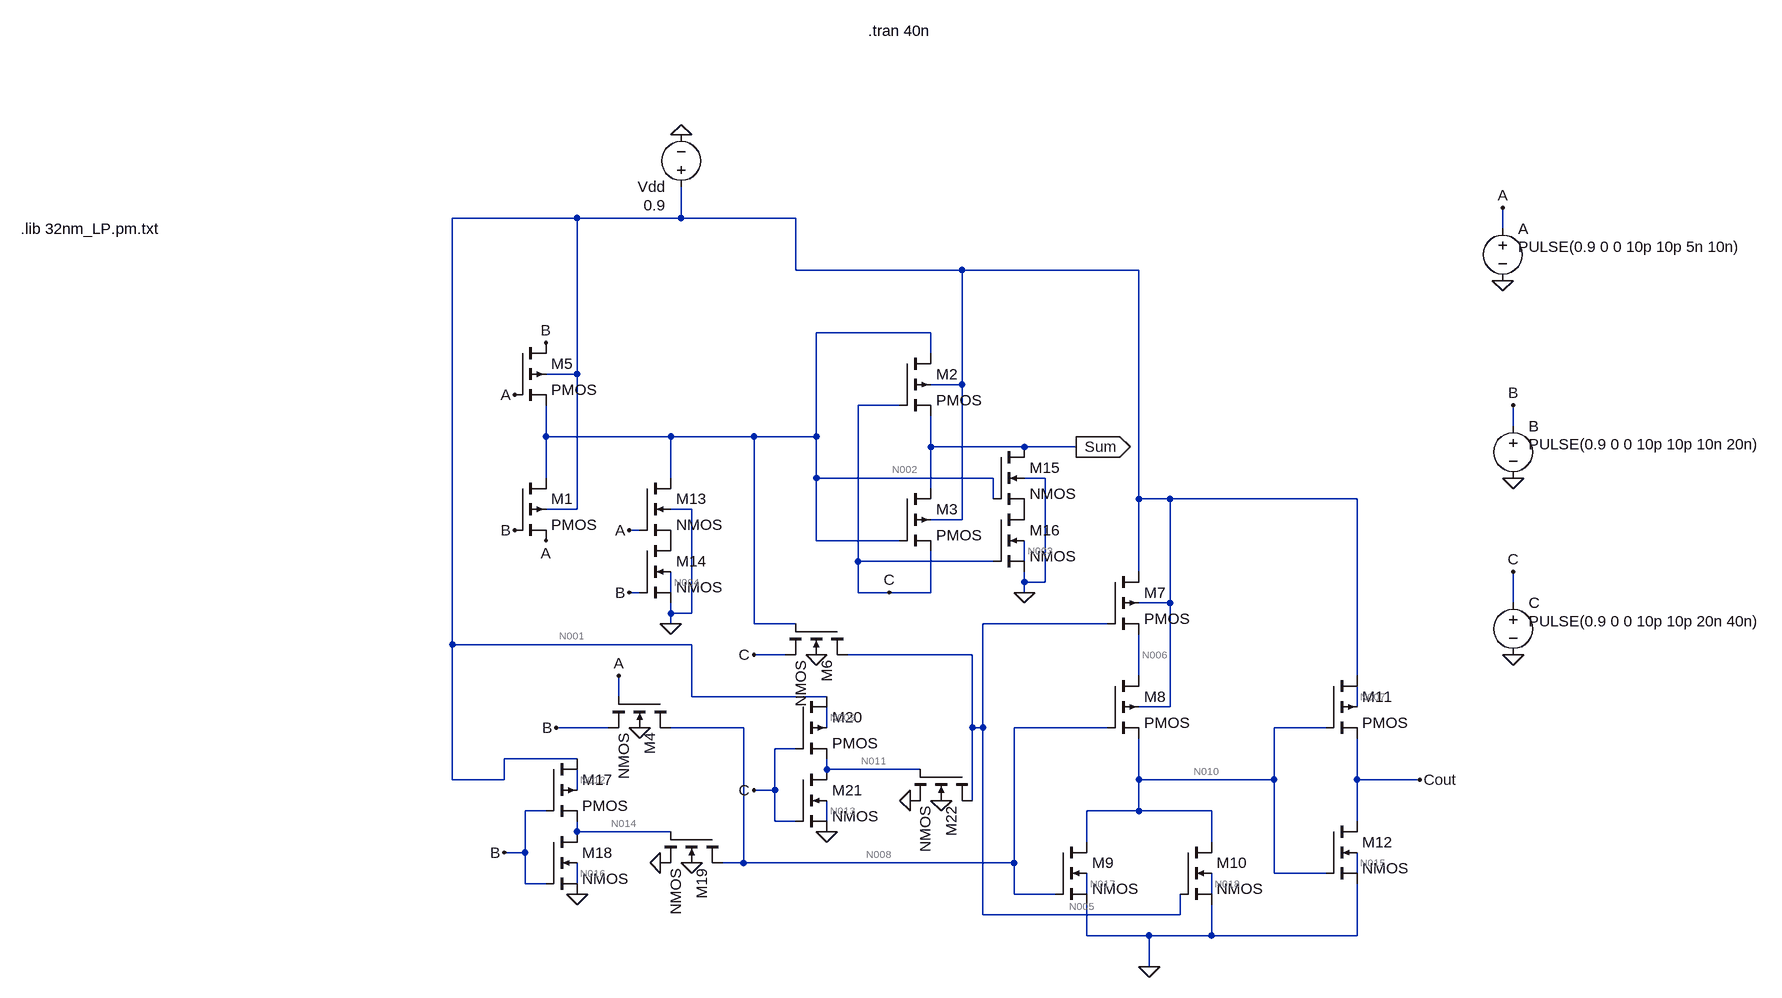
[diagram p0: schematic XA12T_45nm.asc]
XA12T_45nm.asc, the LTspice schematic file:
Version 4
SHEET 1 1060 3520
WIRE -800 -240 -992 -240
WIRE -640 -240 -640 -288
WIRE -640 -240 -800 -240
WIRE -464 -240 -640 -240
WIRE 624 -224 624 -256
WIRE -464 -160 -464 -240
WIRE -208 -160 -464 -160
WIRE 64 -160 -208 -160
WIRE -256 -64 -432 -64
WIRE -256 -32 -256 -64
WIRE -800 0 -800 -240
WIRE -800 0 -848 0
WIRE -208 16 -208 -160
WIRE -208 16 -256 16
WIRE -304 48 -368 48
WIRE 640 80 640 48
WIRE -848 96 -848 48
WIRE -656 96 -848 96
WIRE -528 96 -656 96
WIRE -432 96 -432 -64
WIRE -432 96 -528 96
WIRE -256 112 -256 64
WIRE -112 112 -256 112
WIRE -32 112 -112 112
WIRE -848 160 -848 96
WIRE -656 160 -656 96
WIRE -432 160 -432 96
WIRE -160 160 -432 160
WIRE -80 160 -112 160
WIRE -256 176 -256 112
WIRE -160 192 -160 160
WIRE 64 192 64 -160
WIRE 112 192 64 192
WIRE 400 192 112 192
WIRE -800 208 -800 0
WIRE -800 208 -848 208
WIRE -624 208 -656 208
WIRE -208 224 -208 16
WIRE -208 224 -256 224
WIRE -704 240 -720 240
WIRE -432 256 -432 160
WIRE -304 256 -432 256
WIRE -368 288 -368 48
WIRE -160 288 -368 288
WIRE -112 288 -112 256
WIRE 64 304 64 192
WIRE -112 320 -112 304
WIRE -80 320 -80 160
WIRE -80 320 -112 320
WIRE -704 336 -720 336
WIRE -656 336 -656 304
WIRE -368 336 -368 288
WIRE -320 336 -368 336
WIRE -256 336 -256 272
WIRE -256 336 -320 336
WIRE -112 336 -112 320
WIRE 112 352 112 192
WIRE 112 352 64 352
WIRE 640 352 640 304
WIRE -656 368 -656 352
WIRE -624 368 -624 208
WIRE -624 368 -656 368
WIRE -656 384 -656 368
WIRE -528 384 -528 96
WIRE -464 384 -528 384
WIRE 16 384 -176 384
WIRE -992 416 -992 -240
WIRE -624 416 -992 416
WIRE -480 432 -528 432
WIRE -192 432 -384 432
WIRE 64 464 64 400
WIRE 400 464 400 192
WIRE -736 496 -736 464
WIRE -624 496 -624 416
WIRE -416 496 -624 496
WIRE 112 512 112 352
WIRE 112 512 64 512
WIRE 400 512 400 480
WIRE -752 544 -832 544
WIRE -544 544 -656 544
WIRE -416 544 -416 512
WIRE -192 544 -192 432
WIRE -176 544 -176 384
WIRE -176 544 -192 544
WIRE 16 544 -128 544
WIRE 352 544 272 544
WIRE -464 576 -496 576
WIRE -800 592 -912 592
WIRE -416 608 -416 592
WIRE -272 608 -416 608
WIRE -992 624 -992 416
WIRE -912 624 -912 592
WIRE -912 624 -992 624
WIRE 64 624 64 560
WIRE 272 624 272 544
WIRE 272 624 64 624
WIRE 400 624 400 560
WIRE 496 624 400 624
WIRE -800 640 -800 608
WIRE -496 640 -496 576
WIRE -496 640 -528 640
WIRE -192 656 -192 544
WIRE -848 672 -880 672
WIRE 64 672 64 624
WIRE 64 672 -16 672
WIRE 176 672 64 672
WIRE -496 688 -496 640
WIRE -464 688 -496 688
WIRE -416 688 -416 656
WIRE 400 688 400 624
WIRE -800 704 -800 688
WIRE -656 704 -800 704
WIRE -16 720 -16 672
WIRE 176 720 176 672
WIRE -880 736 -880 672
WIRE -880 736 -912 736
WIRE -544 752 -544 544
WIRE -544 752 -576 752
WIRE -128 752 -128 544
WIRE -128 752 -544 752
WIRE 272 768 272 624
WIRE 352 768 272 768
WIRE 400 768 400 736
WIRE -880 784 -880 736
WIRE -848 784 -880 784
WIRE -800 784 -800 752
WIRE -128 800 -128 752
WIRE -64 800 -128 800
WIRE -16 800 -16 768
WIRE 176 800 176 768
WIRE -176 832 -176 544
WIRE 128 832 128 800
WIRE 128 832 -176 832
WIRE -16 864 -16 816
WIRE 80 864 -16 864
WIRE 176 864 176 816
WIRE 176 864 80 864
WIRE 400 864 400 784
WIRE 400 864 176 864
WIRE 80 912 80 864
FLAG 624 -144 0
FLAG 640 160 0
FLAG 640 432 0
FLAG 624 -256 A
FLAG 640 48 B
FLAG 640 304 C
FLAG -640 -368 0
FLAG -896 32 A
FLAG -848 256 A
FLAG -896 240 B
FLAG -848 -48 B
FLAG -704 544 0
FLAG -432 432 0
FLAG -832 544 B
FLAG -736 464 A
FLAG -528 432 C
FLAG 80 912 0
FLAG 496 624 Cout
FLAG -656 384 0
FLAG -720 240 A
FLAG -720 336 B
FLAG -112 336 0
FLAG -320 336 C
FLAG -32 112 Sum
IOPIN -32 112 Out
FLAG -800 800 0
FLAG -672 752 0
FLAG -624 752 0
FLAG -912 736 B
FLAG -416 704 0
FLAG -288 656 0
FLAG -240 656 0
FLAG -528 640 C
SYMBOL voltage 624 -240 R0
WINDOW 3 24 44 Left 2
WINDOW 123 0 0 Left 0
WINDOW 39 0 0 Left 0
SYMATTR Value PULSE(0.9 0 0 10p 10p 5n 10n)
SYMATTR InstName A
SYMBOL voltage 640 64 R0
WINDOW 3 24 44 Left 2
WINDOW 123 0 0 Left 0
WINDOW 39 0 0 Left 0
SYMATTR Value PULSE(0.9 0 0 10p 10p 10n 20n)
SYMATTR InstName B
SYMBOL voltage 640 336 R0
WINDOW 3 24 44 Left 2
WINDOW 123 0 0 Left 0
WINDOW 39 0 0 Left 0
SYMATTR Value PULSE(0.9 0 0 10p 10p 20n 40n)
SYMATTR InstName C
SYMBOL voltage -640 -272 R180
WINDOW 3 24 -12 Left 2
WINDOW 123 0 0 Left 0
WINDOW 39 0 0 Left 0
SYMATTR Value 0.9
SYMATTR InstName Vdd
SYMBOL pmos4 -896 -48 R0
SYMATTR InstName M5
SYMATTR Value2 l=32n w=128n
SYMBOL nmos4 -704 160 R0
SYMATTR InstName M13
SYMATTR Value2 l=32n w=54n
SYMBOL pmos4 -896 160 R0
SYMATTR InstName M1
SYMATTR Value2 l=32n w=128n
SYMBOL pmos4 -304 -32 R0
SYMATTR InstName M2
SYMATTR Value2 l=32n w=128n
SYMBOL pmos4 -304 176 R0
SYMATTR InstName M3
SYMATTR Value2 l=32n w=128n
SYMBOL nmos4 -704 256 R0
SYMATTR InstName M14
SYMATTR Value2 l=32n w=54n
SYMBOL nmos4 -160 112 R0
SYMATTR InstName M15
SYMATTR Value2 l=32n w=54n
SYMBOL nmos4 -160 208 R0
SYMATTR InstName M16
SYMATTR Value2 l=32n w=54n
SYMBOL nmos4 -656 496 R90
SYMATTR InstName M4
SYMATTR Value2 l=32n w=54n
SYMBOL nmos4 -848 704 R0
SYMATTR InstName M18
SYMATTR Value2 l=32n w=54n
SYMBOL nmos4 -576 704 R90
SYMATTR InstName M19
SYMATTR Value2 l=32n w=54n
SYMBOL pmos4 -848 592 R0
SYMATTR InstName M17
SYMATTR Value2 l=32n w=128n
SYMBOL nmos4 -384 384 R90
SYMATTR InstName M6
SYMATTR Value2 l=32n w=54n
SYMBOL nmos4 -464 608 R0
SYMATTR InstName M21
SYMATTR Value2 l=32n w=54n
SYMBOL nmos4 -192 608 R90
SYMATTR InstName M22
SYMATTR Value2 l=32n w=54n
SYMBOL pmos4 -464 496 R0
SYMATTR InstName M20
SYMATTR Value2 l=32n w=128n
SYMBOL pmos4 16 304 R0
SYMATTR InstName M7
SYMATTR Value2 l=32n w=128n
SYMBOL pmos4 16 464 R0
SYMATTR InstName M8
SYMATTR Value2 l=32n w=128n
SYMBOL pmos4 352 464 R0
SYMATTR InstName M11
SYMATTR Value2 l=32n w=128n
SYMBOL nmos4 -64 720 R0
SYMATTR InstName M9
SYMATTR Value2 l=32n w=54n
SYMBOL nmos4 128 720 R0
SYMATTR InstName M10
SYMATTR Value2 l=32n w=54n
SYMBOL nmos4 352 688 R0
SYMATTR InstName M12
SYMATTR Value2 l=32n w=54n
TEXT -352 -528 Left 2 !.tran 40n
TEXT -1656 -224 Left 2 !.lib 32nm_LP.pm.txt

The netlist it stands for:
* XA12T_45nm.asc
V§A A 0 PULSE(0.9 0 0 10p 10p 5n 10n)
V§B B 0 PULSE(0.9 0 0 10p 10p 10n 20n)
V§C C 0 PULSE(0.9 0 0 10p 10p 20n 40n)
Vdd N001 0 0.9
M5 B A N002 N001 PMOS l=32n w=128n
M13 N002 A P001 0 NMOS l=32n w=54n
M1 N002 B A N001 PMOS l=32n w=128n
M2 N002 C Sum N001 PMOS l=32n w=128n
M3 Sum N002 C N001 PMOS l=32n w=128n
M14 P001 B 0 N004 NMOS l=32n w=54n
M15 Sum N002 P002 0 NMOS l=32n w=54n
M16 P002 C 0 N003 NMOS l=32n w=54n
M4 N008 A B 0 NMOS l=32n w=54n
M18 N014 B 0 N016 NMOS l=32n w=54n
M19 N008 N014 0 0 NMOS l=32n w=54n
M17 N001 B N014 N012 PMOS l=32n w=128n
M6 N005 N002 C 0 NMOS l=32n w=54n
M21 N011 C 0 N013 NMOS l=32n w=54n
M22 N005 N011 0 0 NMOS l=32n w=54n
M20 N001 C N011 N009 PMOS l=32n w=128n
M7 N001 N005 N006 N001 PMOS l=32n w=128n
M8 N006 N008 N010 N001 PMOS l=32n w=128n
M11 N001 N010 Cout N007 PMOS l=32n w=128n
M9 N010 N008 0 N017 NMOS l=32n w=54n
M10 N010 N005 0 N018 NMOS l=32n w=54n
M12 Cout N010 0 N015 NMOS l=32n w=54n
.model NMOS NMOS
.model PMOS PMOS
.lib standard.mos
.tran 40n
.lib 32nm_LP.pm.txt
.backanno
.end

* Results of the author's LTspice run, read from the files saved beside the schematic
* Operating Point, zero values left out:
*   V(a) = 900 mV
*   V(b) = 900 mV
*   V(c) = 900 mV
*   V(n001) = 900 mV
*   V(n002) = 63.35 µV
*   V(p001) = 31.33 µV
*   V(sum) = 900 mV
*   V(n004) = 105.1 mV
*   V(p002) = 9.862 µV
*   V(n003) = 105.1 mV
*   V(n008) = 671.3 mV
*   V(n014) = 23.32 µV
*   V(n016) = 105.1 mV
*   V(n012) = 771.7 mV
*   V(n005) = 104.8 mV
*   V(n011) = 23.3 µV
*   V(n013) = 105.1 mV
*   V(n009) = 771.7 mV
*   V(n006) = 897.1 mV
*   V(n010) = 3.941 mV
*   V(cout) = 900 mV
*   V(n007) = 767 mV
*   V(n017) = 5.732 mV
*   V(n018) = 1.61 mV
*   V(n015) = 259.1 mV
*   Id(M12) = 13.86 nA
*   Ig(M12) = -17.33 pA
*   Is(M12) = -13.84 nA
*   Id(M10) = 61.1 pA
*   Is(M10) = -61.12 pA
*   Id(M9) = 666.5 nA
*   Ig(M9) = 6.741 pA
*   Is(M9) = -666.5 nA
*   Id(M22) = 46.93 pA
*   Is(M22) = -46.73 pA
*   Id(M21) = 5.429 nA
*   Ig(M21) = 29.48 pA
*   Is(M21) = -5.458 nA
*   Id(M6) = -46.73 pA
*   Ig(M6) = -17.72 pA
*   Ib(M6) = -1.015 pA
*   Is(M6) = 65.46 pA
*   Id(M19) = 754.9 pA
*   Ig(M19) = -6.062 pA
*   Is(M19) = -748.2 pA
*   Id(M18) = 5.435 nA
*   Ig(M18) = 29.48 pA
*   Is(M18) = -5.464 nA
*   Id(M4) = -761.7 pA
*   Ib(M4) = -1.584 pA
*   Is(M4) = 763.2 pA
*   Id(M16) = 2.289 nA
*   Ig(M16) = 29.48 pA
*   Is(M16) = -2.319 nA
*   Id(M15) = 2.308 nA
*   Ig(M15) = -17.63 pA
*   Is(M15) = -2.289 nA
*   Id(M14) = 7.306 nA
*   Ig(M14) = 29.48 pA
*   Is(M14) = -7.335 nA
*   Id(M13) = 7.277 nA
*   Ig(M13) = 29.62 pA
*   Ib(M13) = -1.012 pA
*   Is(M13) = -7.306 nA
*   Id(M11) = 13.86 nA
*   Ig(M11) = -1.207 pA
*   Is(M11) = -13.86 nA
*   Id(M8) = 666.6 nA
*   Is(M8) = -666.6 nA
*   Id(M7) = 666.6 nA
*   Is(M7) = -666.6 nA
*   Id(M20) = 5.429 nA
*   Is(M20) = -5.429 nA
*   Id(M17) = 5.429 nA
*   Is(M17) = -5.429 nA
*   Id(M3) = -4.719 nA
*   Ig(M3) = -1.579 pA
*   Ib(M3) = 1.576 pA
*   Is(M3) = 4.719 nA
*   Id(M2) = -2.412 nA
*   Is(M2) = 2.411 nA
*   Id(M1) = -2.414 nA
*   Is(M1) = 2.413 nA
*   Id(M5) = 2.413 nA
*   Is(M5) = -2.414 nA
*   I(Vdd) = -691.3 nA
*   I(C) = -4.844 nA
*   I(B) = -3.235 nA
*   I(A) = -2.443 nA
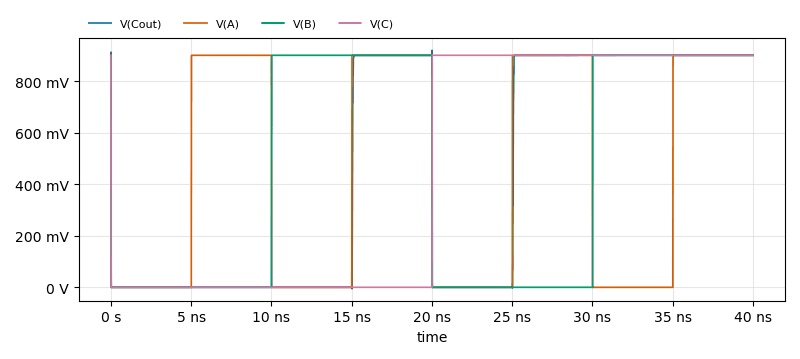
[diagram p1: Transient Analysis of XA12T_45nm.asc, plotted from the saved traces]
* Transient Analysis, 1 run:
*   V(Cout): min -5.715 mV, max 919.1 mV, average 448 mV, rms 634.5 mV, last 899.9 mV
*   V(A): min 0 V, max 900 mV, average 449.1 mV, rms 635.6 mV, last 900 mV
*   V(B): min 0 V, max 900 mV, average 449.5 mV, rms 636 mV, last 900 mV
*   V(C): min 0 V, max 900 mV, average 449.8 mV, rms 636.2 mV, last 900 mV